# EAGLE design ruido_v5_led (EAGLE 5.10)
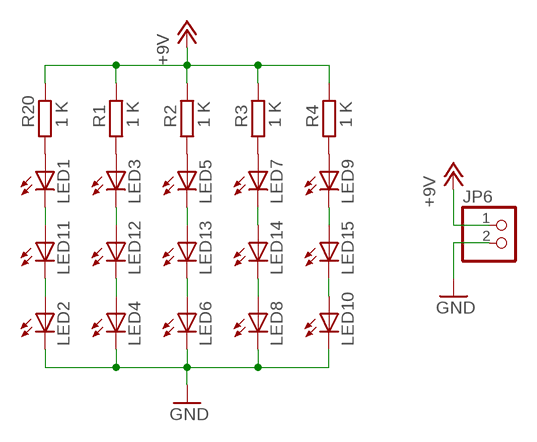
[diagram p0: schematic, sheet 1]

## Parts
JP6  PINHD-1X2  [1X02]
LED1  LEDLED10MM  [LED10MM]
LED2  LEDLED10MM  [LED10MM]
LED3  LEDLED10MM  [LED10MM]
LED4  LEDLED10MM  [LED10MM]
LED5  LEDLED10MM  [LED10MM]
LED6  LEDLED10MM  [LED10MM]
LED7  LEDLED10MM  [LED10MM]
LED8  LEDLED10MM  [LED10MM]
LED9  LEDLED10MM  [LED10MM]
LED10  LEDLED10MM  [LED10MM]
LED11  LEDLED10MM  [LED10MM]
LED12  LEDLED10MM  [LED10MM]
LED13  LEDLED10MM  [LED10MM]
LED14  LEDLED10MM  [LED10MM]
LED15  LEDLED10MM  [LED10MM]
R1  1 K  R-EU_  [0207/7]
R2  1 K  R-EU_  [0207/7]
R3  1 K  R-EU_  [0207/7]
R4  1 K  R-EU_  [0207/7]
R20  1 K  R-EU_  [0207/7]

## Nets
+12V: JP6.1 R1.2 R2.2 R3.2 R4.2 R20.2 ; supply symbol labelled +9V
GND: JP6.2 LED2.K(C) LED4.K(C) LED6.K(C) LED8.K(C) LED10.K(C)
N$1: LED1.K(C) LED11.A
N$2: LED3.A R1.1
N$3: LED2.A LED11.K(C)
N$4: LED5.A R2.1
N$5: LED3.K(C) LED12.A
N$6: LED7.A R3.1
N$7: LED4.A LED12.K(C)
N$8: LED9.A R4.1
N$9: LED5.K(C) LED13.A
N$10: LED6.A LED13.K(C)
N$11: LED8.A LED14.K(C)
N$12: LED7.K(C) LED14.A
N$13: LED9.K(C) LED15.A
N$14: LED10.A LED15.K(C)
N$30: LED1.A R20.1

## Library data of the parts
JP6 = ruido:PINHD-1X2: PIN HEADER
LED1-LED15 = ruido:LED: LED OSRAM: - CHIPLED LG R971, LG N971, LY N971, LG Q971, LY Q971, LO R971, LY R971 LH N974, LH R974 LS Q976, LO Q976, LY Q976 LO Q996 - Hyper CHIPLED LW Q18S LB Q993, LB Q99A, LB R99A - SideLED LS A670, LO A670, LY A670, LG A670, LP A670 LB A673, LV A673, LT A673, LW A673 LH A674 LY A675 LS A676, LA A676, LO A676, LY A676, LW A676 LS A679, LY A679, LG A679 - Hyper Micro SIDELED® LS Y876, LA Y876, LO Y876, LY Y876 LT Y87S - SmartLED LW L88C, LW L88S LB L89C, LB L89S, LG L890 LS L89K, LO L89K, LY L89K LS L896, LA L896, LO L896, LY L896 - TOPLED LS T670, LO T670, LY T670, LG T670, LP T670 LSG T670, LSP T670, LSY T670, LOP T670, LYG T670 LG T671, LOG T671, LSG T671 LB T673, LV T673, LT T673, LW T673 LH T674 LS T676, LA T676, LO T676, LY T676, LB T676, LH T676, LSB T676, LW T676 LB T67C, LV T67C, LT T67C, LS T67K, LO T67K, LY T67K, LW E67C LS E67B, LA E67B, LO E67B, LY E67B, LB E67C, LV E67C, LT E67C LW T67C LS T679, LY T679, LG T679 LS T770, LO T770, LY T770, LG T770, LP T770 LB T773, LV T773, LT T773, LW T773 LH T774 LS E675, LA E675, LY E675, LS T675 LS T776, LA T776, LO T776, LY T776, LB T776 LHGB T686 LT T68C, LB T68C - Hyper Mini TOPLED® LB M676 - Mini TOPLED Santana® LG M470 LS M47K, LO M47K, LY M47K Source: http://www.osram.convergy.de - LUMILED® LXK2-PW12-R00, LXK2-PW12-S00, LXK2-PW14-U00, LXK2-PW14-V00 LXK2-PM12-R00, LXK2-PM12-S00, LXK2-PM14-U00 LXK2-PE12-Q00, LXK2-PE12-R00, LXK2-PE12-S00, LXK2-PE14-T00, LXK2-PE14-U00 LXK2-PB12-K00, LXK2-PB12-L00, LXK2-PB12-M00, LXK2-PB14-N00, LXK2-PB14-P00, LXK2-PB14-Q00 LXK2-PR12-L00, LXK2-PR12-M00, LXK2-PR14-Q00, LXK2-PR14-R00 LXK2-PD12-Q00, LXK2-PD12-R00, LXK2-PD12-S00 LXK2-PH12-R00, LXK2-PH12-S00 LXK2-PL12-P00, LXK2-PL12-Q00, LXK2-PL12-R00 Source: www.luxeon.com
R1-R4 R20 = ruido:R-EU_: RESISTOR, European symbol

## Board
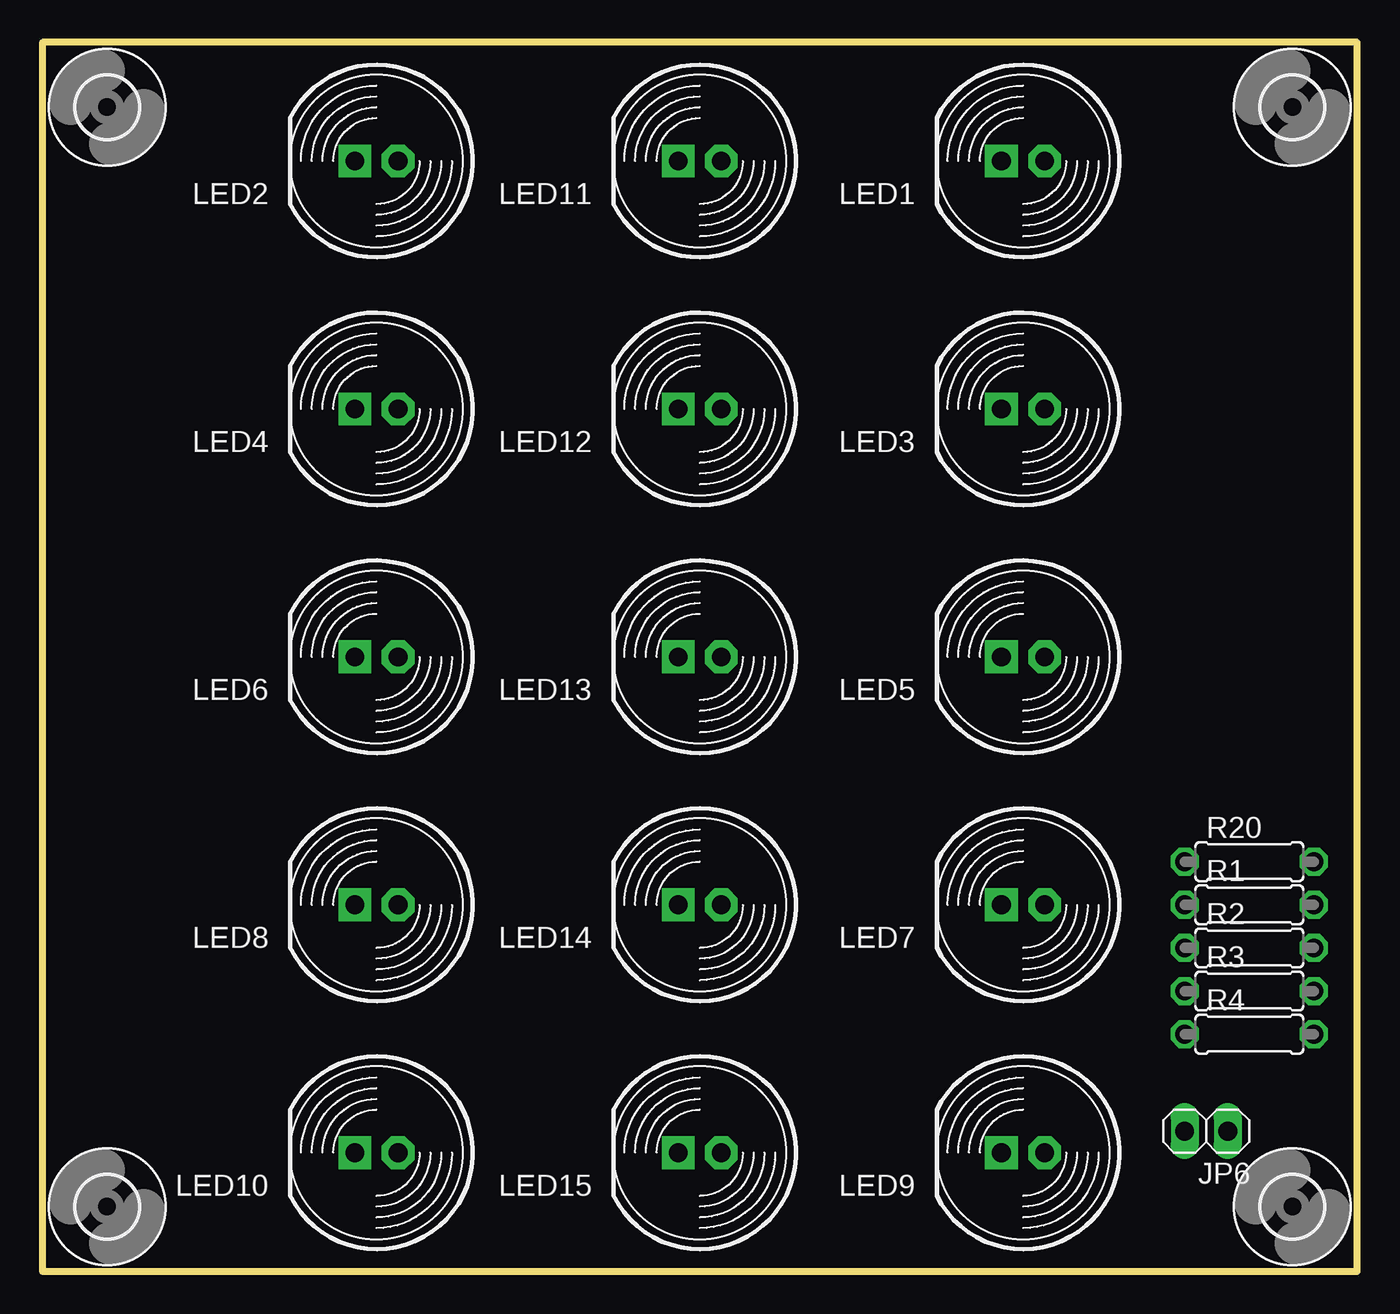
[diagram p1: board, top side]
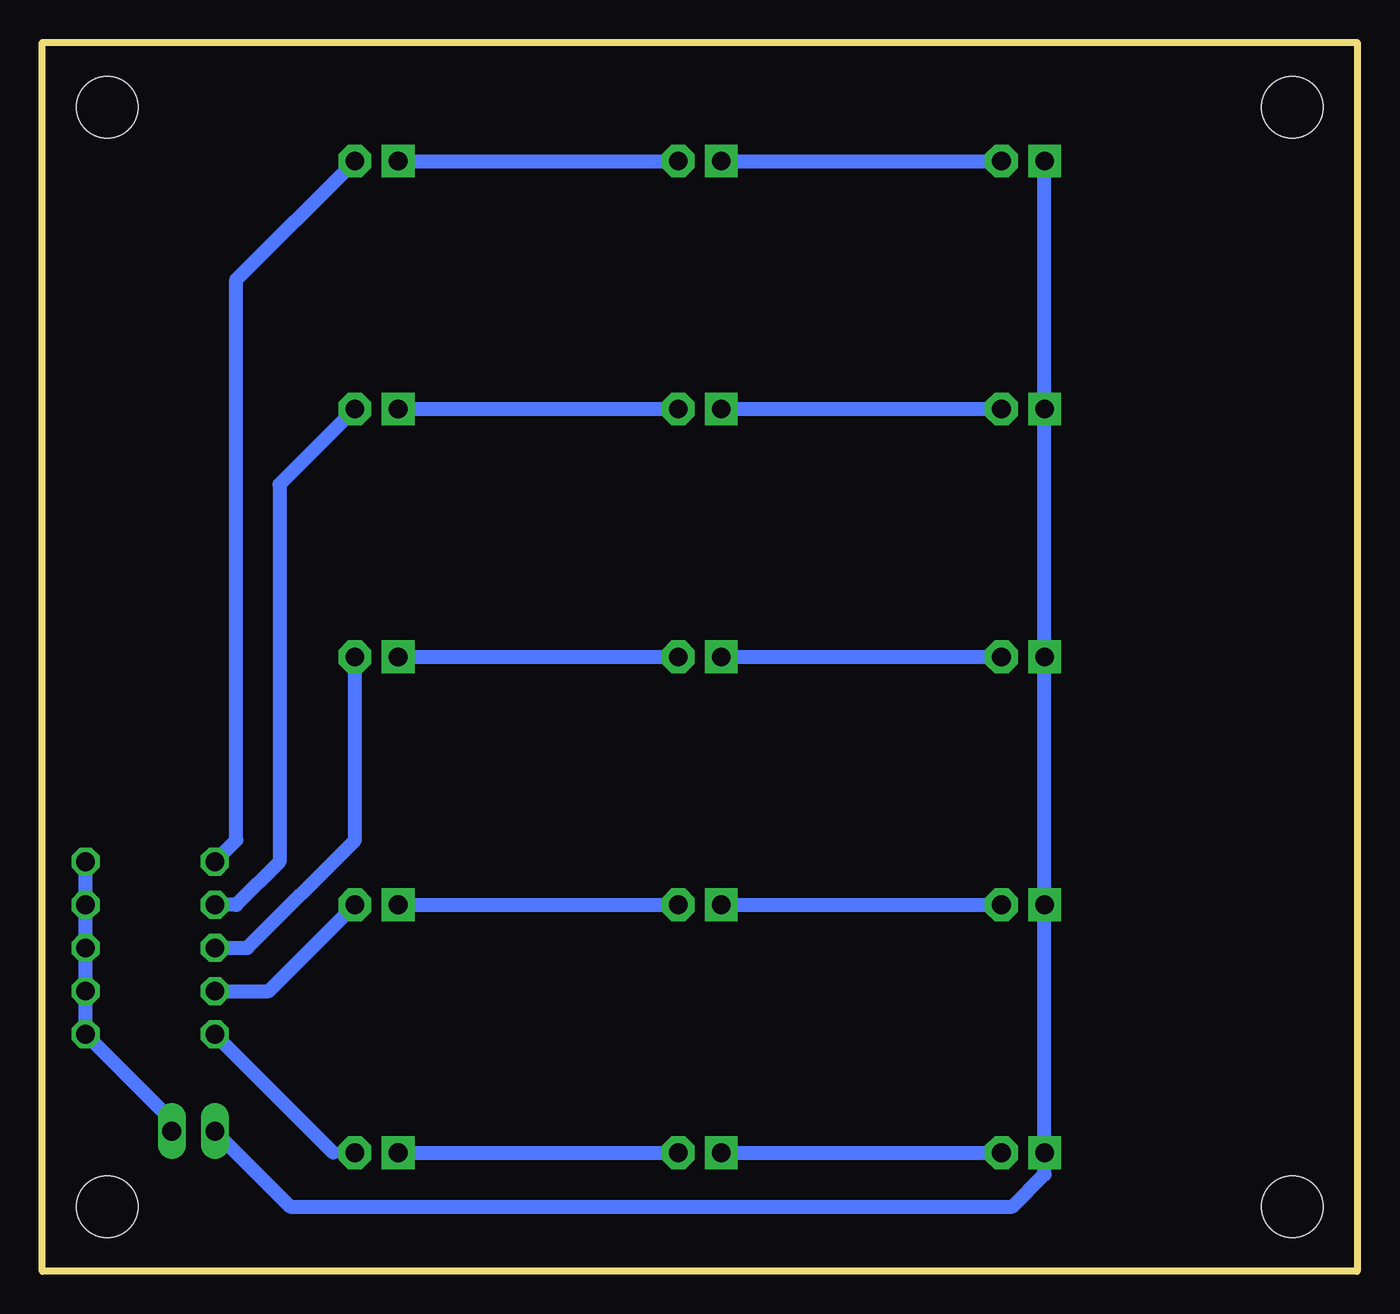
[diagram p2: board, bottom side, seen from below]

Size 77.47 x 72.39 mm. Coordinates in mm from the lower left corner, seen from the top.
Outline: 77.47,0 77.47,72.39 0,72.39 0,0 77.47,0
Copper layers (1*16): Top 0.035mm / dielectric 1.5mm / Bottom 0.035mm
Design rules "default": minimum track width 10mil, minimum drill 24mil, track to track 8mil, track to pad 8mil, pad to pad 8mil, via to via 8mil, smd to smd 8mil, copper to edge 40mil, drill to drill 8mil, minimum pad ring 10mil, minimum via ring 8mil, stop-mask expansion 4mil, vias tented up to drill 0mil, thermal gap 10mil

### Footprints (pad centres in the part's own frame; a part is rotated, then mirrored left to right if it is on the bottom)
1X02 = drill 1.1 long: 1 -1.27,0; 2 1.27,0
LED10MM = drill 1.1 pad 1.93 octagon: A -1.27,0 | drill 1.1 pad 1.93 square: K 1.27,0
0207/7 = drill 1.1 octagon: 1 -3.81,0; 2 3.81,0
3,6 = hole 3.6: 0,0

### Placement (x,y rotation side)
JP6  68.58,8.26 180 top
LED1  57.78,65.41 180 top
LED2  19.68,65.41 180 top
LED3  57.78,50.8 180 top
LED4  19.68,50.8 180 top
LED5  57.78,36.2 180 top
LED6  19.68,36.2 180 top
LED7  57.78,21.59 180 top
LED8  19.68,21.59 180 top
LED9  57.78,6.99 180 top
LED10  19.68,6.99 180 top
LED11  38.73,65.41 180 top
LED12  38.73,50.8 180 top
LED13  38.73,36.2 180 top
LED14  38.73,21.59 180 top
LED15  38.73,6.99 180 top
R1  71.12,21.59 0 top
R2  71.12,19.05 0 top
R3  71.12,16.51 0 top
R4  71.12,13.97 0 top
R20  71.12,24.13 0 top
U$2  [3,6]  73.66,3.81 90 top
U$3  [3,6]  73.66,68.58 90 top
U$4  [3,6]  3.81,68.58 90 top
U$5  [3,6]  3.81,3.81 90 top

### Tracks (layer width: path | path; a pad name or v marks a point on that pad's centre or on a via)
+12V
  Bottom 0.813: JP6.1 69.85,8.89 R4.2 R3.2 R2.2 R1.2 R20.2
GND
  Bottom 0.813: LED2.K LED4.K LED6.K LED8.K LED10.K 18.41,5.71 20.32,3.81 62.87,3.81 JP6.2
N$1
  Bottom 0.813: LED1.K LED11.A
N$2
  Bottom 0.813: LED3.A 63.5,46.35 63.5,24.13 66.04,21.59 R1.1
N$3
  Bottom 0.813: LED11.K LED2.A
N$4
  Bottom 0.813: R2.1 65.41,19.05 59.05,25.4 LED5.A
N$5
  Bottom 0.813: LED3.K LED12.A
N$6
  Bottom 0.813: R3.1 64.14,16.51 LED7.A
N$7
  Bottom 0.813: LED12.K LED4.A
N$8
  Bottom 0.61: LED9.A 60.33,6.99
  Bottom 0.813: 60.33,6.99 R4.1
N$9
  Bottom 0.813: LED5.K LED13.A
N$10
  Bottom 0.813: LED13.K LED6.A
N$11
  Bottom 0.813: LED14.K LED8.A
N$12
  Bottom 0.813: LED7.K LED14.A
N$13
  Bottom 0.813: LED9.K LED15.A
N$14
  Bottom 0.813: LED15.K LED10.A
N$30
  Bottom 0.813: R20.1 66.04,25.4 66.04,58.42 LED1.A